# EAGLE design bikeSensor (EAGLE 7.3.0)
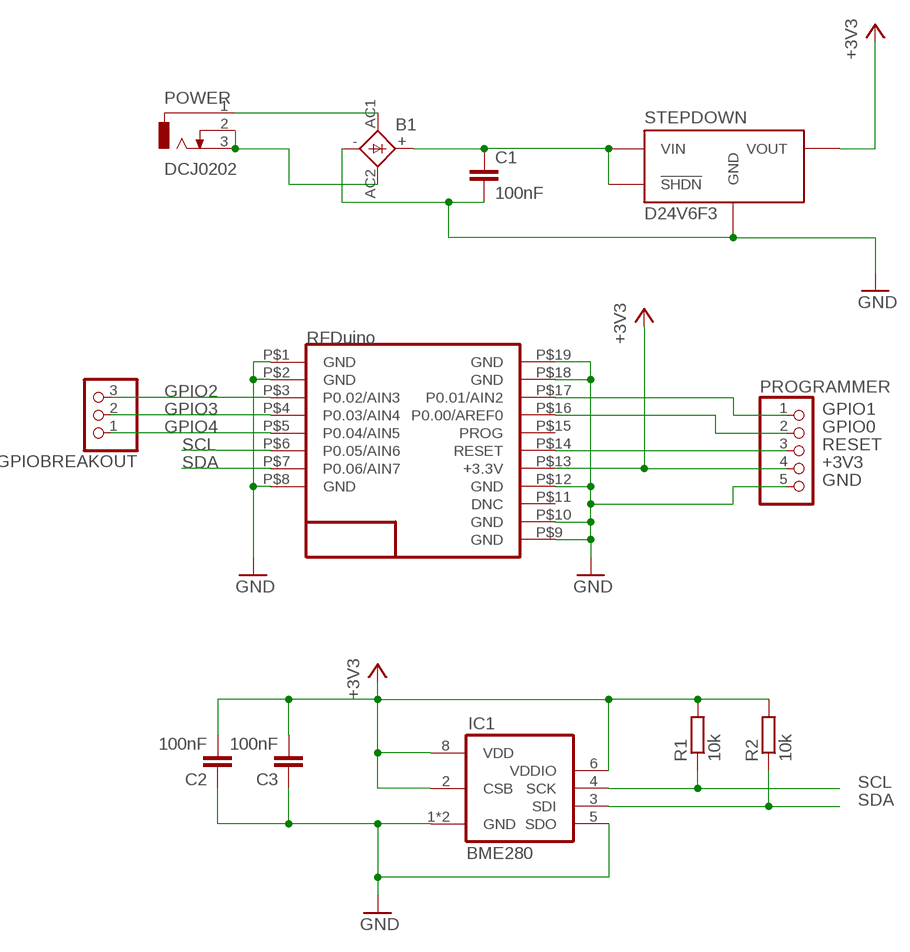
[diagram p0: schematic, sheet 1]

## Parts
B1  1KAB  [1KAB]
C1  100nF  C-EU025-050X050  [C025-050X050]
C2  100nF  C-EUC1812  [C1812]
C3  100nF  C-EUC1812  [C1812]
GPIOBREAKOUT  PINHD-1X3  [1X03]
IC1  BME280  [BME280]
POWER  DCJ0202  [DCJ0202]
PROGRAMMER  PINHD-1X5  [1X05]
R1  10k  R-EU_R1206  [R1206]
R2  10k  R-EU_R1206  [R1206]
RFDUINO  RFD22301  [RFD21733]
STEPDOWN  D24V6F3  [D24V6F3]

## Nets
+3V3: C2.2 C3.2 IC1.2(CSB) IC1.6(VDDIO) IC1.8(VDD) PROGRAMMER.4 R1.2 R2.2 RFDUINO.P$13(+3.3V) STEPDOWN.VOUT
GND: B1.- C1.2 C2.1 C3.1 IC1.1(GND) IC1.5(SDO) IC1.7(GND) PROGRAMMER.5 RFDUINO.P$1(GND) RFDUINO.P$2(GND) RFDUINO.P$8(GND) RFDUINO.P$9(GND) RFDUINO.P$10(GND) RFDUINO.P$12(GND) RFDUINO.P$18(GND) RFDUINO.P$19(GND) STEPDOWN.GND
GPIO0: PROGRAMMER.2 RFDUINO.P$16(P0.00/AREF0)
GPIO1: PROGRAMMER.1 RFDUINO.P$17(P0.01/AIN2)
GPIO2: GPIOBREAKOUT.3 RFDUINO.P$3(P0.02/AIN3)
GPIO3: GPIOBREAKOUT.2 RFDUINO.P$4(P0.03/AIN4)
GPIO4: GPIOBREAKOUT.1 RFDUINO.P$5(P0.04/AIN5)
N$1 [power]: B1.AC2 POWER.2 POWER.3
N$2 [power]: B1.AC1 POWER.1
N$5 [power]: B1.+ C1.1 STEPDOWN.!SHDN STEPDOWN.VIN
RESET: PROGRAMMER.3 RFDUINO.P$14(RESET)
SCL: IC1.4(SCK) R1.1 RFDUINO.P$6(P0.05/AIN6)
SDA: IC1.3(SDI) R2.1 RFDUINO.P$7(P0.06/AIN7)
Unconnected: RFDUINO.P$11(DNC) RFDUINO.P$15(PROG)

## Notes on the sheet
- RFDuino

## Library data of the parts
B1 = rectifier:1KAB: RECTIFIER grid 5,08 x 5,08 mm
C1-C3 = rcl:C-EU: CAPACITOR, European symbol
GPIOBREAKOUT = pinhead:PINHD-1X3: PIN HEADER
IC1 = bosch-bme280:BME280: DIGITAL HUMIDITY, PRESSURE AND TEMPERATURE SENSOR * Digital interface I²C (up to 3.4 MHz) and SPI (3 and 4 wire, up to 10 MHz)* Supply voltage VDD main supply voltage range: 1.71 V to 3.6 V*VDDIO interface voltage range: 1.2 V to 3.6 V Operating range -40…+85 °C, 0…100 % rel. humidity, 300…1100 hPa The library has been designed by Richard Magdycz <https://www.facebook.com/groups/eaglecadsoftUK>
POWER = con-jack:DCJ0202: DC POWER JACK Source: DCJ0202.pdf; OC_FARNELL: unknown; OC_NEWARK: unknown
PROGRAMMER = pinhead:PINHD-1X5: PIN HEADER
R1 R2 = rcl:R-EU_: RESISTOR, European symbol
RFDUINO = RFD22301-11.25.13:RFD22301: RF Digital RFD22301
STEPDOWN = scout:D24V6F3

## Net classes
1 power: width 0.813 mm, clearance 0.813 mm

## Board
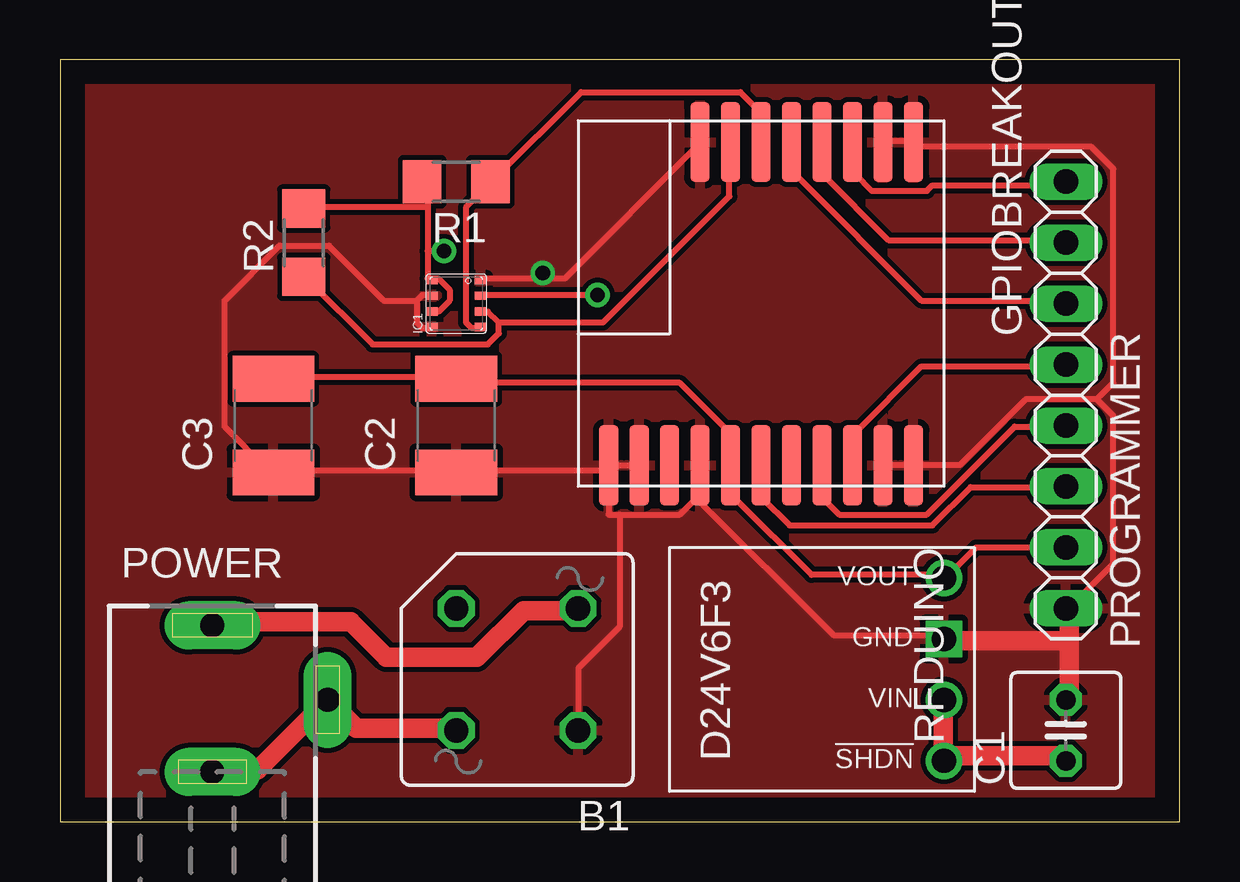
[diagram p1: board, top side]
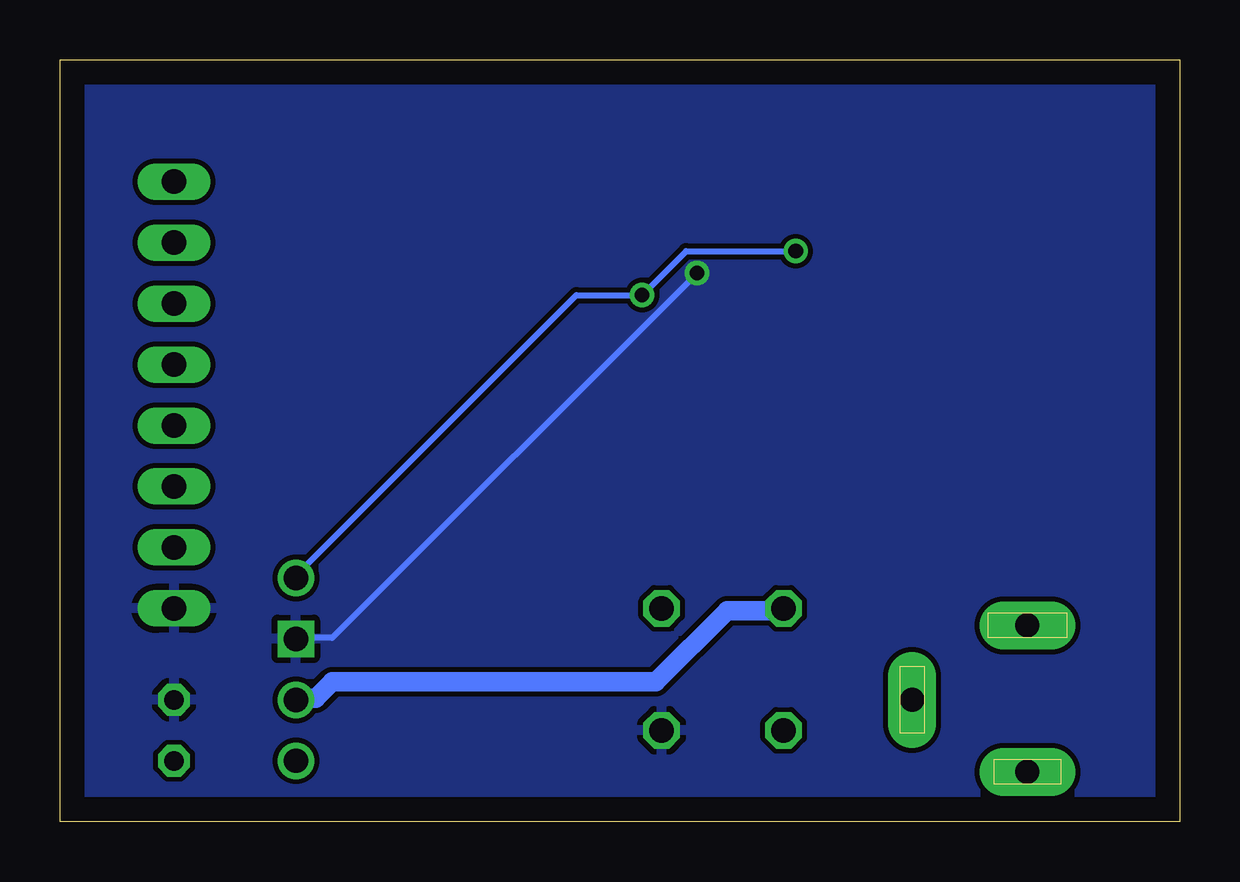
[diagram p2: board, bottom side, seen from below]

Size 46.66 x 31.74 mm. Coordinates in mm from the lower left corner, seen from the top.
Outline: 0,0 46.66,0 46.66,31.74 0,31.74 0,0
Copper layers (1*16): Top 0.035mm / dielectric 1.5mm / Bottom 0.035mm
Design rules "default": minimum track width 10mil, minimum drill 24mil, track to track 8mil, track to pad 8mil, pad to pad 8mil, via to via 8mil, smd to smd 8mil, copper to edge 40mil, drill to drill 8mil, minimum pad ring 10mil, minimum via ring 8mil, stop-mask expansion 4mil, vias tented up to drill 0mil, thermal gap 10mil

### Footprints (pad centres in the part's own frame; a part is rotated, then mirrored left to right if it is on the bottom)
1KAB = drill 1.016 octagon: + 2.54,-2.54; - -2.54,2.54; AC1 -2.54,-2.54; AC2 2.54,2.54
C025-050X050 = drill 0.813 octagon: 1 -1.27,0; 2 1.27,0
C1812 = smd 1.9 x 3.4: 1 -1.95,0; 2 1.95,0
1X03 = drill 1.016 long: 1 -2.54,0; 2 0,0; 3 2.54,0
BME280 = smd 0.35 x 0.5: 1 0.975,-1.025; 2 0.325,-1.025; 3 -0.325,-1.025; 4 -0.975,-1.025; 5 -0.975,1.025; 6 -0.325,1.025; 7 0.325,1.025; 8 0.975,1.025
DCJ0202 = drill 1 pad 2 long: 1 0,3.1; 2 4.8,0; 3 0,-3
1X05 = drill 1.016 long: 1 -5.08,0; 2 -2.54,0; 3 0,0; 4 2.54,0; 5 5.08,0
R1206 = smd 1.6 x 1.803: 1 -1.422,0; 2 1.422,0
RFD21733 = smd 3.353 x 0.813: P$1 -6.731,6.35; P$2 -6.731,5.08; P$3 -6.731,3.81; P$4 -6.731,2.54; P$5 -6.731,1.27; P$6 -6.731,0; P$7 -6.731,-1.27; P$8 -6.731,-2.54; P$9 6.731,-6.35; P$10 6.731,-5.08; P$11 6.731,-3.81; P$12 6.731,-2.54; P$13 6.731,-1.27; P$14 6.731,0; P$15 6.731,1.27; P$16 6.731,2.54; P$17 6.731,3.81; P$18 6.731,5.08; P$19 6.731,6.35
D24V6F3 = drill 1.016: !SHDN -3.81,-5.08; VIN -1.27,-5.08; VOUT 3.81,-5.08 | drill 1.016 square: GND 1.27,-5.08

### Placement (x,y rotation side)
B1  19.05,6.35 180 top
C1  41.91,3.81 90 top
C2  16.51,16.51 90 top
C3  8.89,16.51 90 top
GPIOBREAKOUT  41.91,24.13 90 top
IC1  16.51,21.59 90 top
POWER  6.35,5.08 0 top
PROGRAMMER  41.91,13.97 270 top
R1  16.51,26.67 180 top
R2  10.16,24.13 90 top
RFDUINO  29.21,21.59 270 top
STEPDOWN  31.75,6.35 90 top

### Tracks (layer width: path | path; a pad name or v marks a point on that pad's centre or on a via)
+3V3  (via drill 0.61)
  Top 0.254: C3.2 8.91,18.52 16.46,18.52 C2.2 16.69,18.29 25.83,18.29 27.89,16.23 27.89,14.86 RFDUINO.P$13 28.12,14.86 28.12,13.49 31.32,10.29 36.8,10.29 STEPDOWN.VOUT 37.03,10.29 38.18,11.43 PROGRAMMER.4 | IC1.6 15.54,21.26 15.77,21.26 16.23,21.72 16.23,22.17 15.77,22.63 15.54,22.63 IC1.8 15.32,22.63 15.32,23.77 | 15.32,25.6 15.32,26.52 R1.2 | 15.32,25.6 15.32,23.77 | 15.32,25.6 10.29,25.6 R2.2 | v22.4,21.95 17.6,21.95 IC1.2 | v16,23.77 15.32,23.77
  Bottom 0.254: STEPDOWN.VOUT 36.8,10.29 25.15,21.95 v22.4,21.95 20.57,23.77 v16,23.77
GND  (via drill 0.61)
  Top 0.254: RFDUINO.P$2 34.29,28.35 35.43,28.35 RFDUINO.P$1 35.66,28.12 42.98,28.12 43.89,27.2 43.89,18.29 43.2,17.6 | RFDUINO.P$18 RFDUINO.P$19 37.49,14.86 40.23,17.6 43.2,17.6 | 42.06,5.26 C1.2 | 42.06,8.69 PROGRAMMER.5 42.06,8.91 43.89,10.74 43.89,16.92 43.2,17.6 | 37.03,7.54 STEPDOWN.GND 36.8,7.77 32.23,7.77 26.52,13.49 | 14.86,21.72 14.86,20.8 15.09,20.57 15.32,20.57 IC1.5 | 14.86,21.72 15.09,21.95 15.32,21.95 IC1.7 | 14.86,21.72 13.49,21.72 11.2,24 9.14,24 6.86,21.72 6.86,16.46 8.69,14.63 C3.1 8.91,14.63 16.46,14.63 C2.1 16.69,14.63 22.86,14.63 | 20.12,22.63 21.03,22.63 26.52,28.12 RFDUINO.P$8 | 20.12,22.63 17.6,22.63 IC1.1 | 22.86,14.63 22.86,12.8 23.32,12.8 | RFDUINO.P$10 RFDUINO.P$9 22.86,14.63 | 26.52,13.49 26.52,14.86 RFDUINO.P$12 26.52,13.49 | 26.52,13.49 25.83,12.8 23.32,12.8 | v20.12,22.86 20.12,22.63 | 23.32,12.8 23.32,8.12 21.6,6.4 21.6,3.89 B1.-
  Top 0.813: 42.06,8.69 42.06,7.54 | 42.06,7.54 42.06,5.26 | 42.06,7.54 37.03,7.54
  Bottom 0.254: v20.12,22.86 35.32,7.66 36.8,7.66 STEPDOWN.GND
  pour Top: 0,31.75 46.99,31.75 46.99,0 0,0
  pour Bottom: 0,0 0,31.75 46.99,31.75 46.99,0
GPIO0
  Top 0.254: PROGRAMMER.2 41.83,16.46 39.78,16.46 36.12,12.8 32.46,12.8 31.77,13.49 31.77,14.86 RFDUINO.P$16
GPIO1
  Top 0.254: PROGRAMMER.1 41.83,18.97 35.89,18.97 33.15,16.23 33.15,14.86 RFDUINO.P$17
GPIO2
  Top 0.254: GPIOBREAKOUT.3 41.83,26.52 36.35,26.52 36.12,26.29 33.83,26.29 33.15,26.98 33.15,28.12 RFDUINO.P$3
GPIO3
  Top 0.254: GPIOBREAKOUT.2 41.83,24.23 34.52,24.23 31.77,26.98 31.77,28.12 RFDUINO.P$4
GPIO4
  Top 0.254: GPIOBREAKOUT.1 41.83,21.72 35.89,21.72 30.63,26.98 30.63,28.12 RFDUINO.P$5
N$1
  Top 0.813: B1.AC2 16.46,3.89 12.34,3.89 11.2,5.03 POWER.2 10.86,4.8 8.23,2.17 6.4,2.17 POWER.3
N$2
  Top 0.813: B1.AC1 21.49,8.8 19.32,8.8 17.37,6.86 13.6,6.86 12.12,8.34 6.51,8.34 6.4,8.23 POWER.1
N$5
  Top 0.813: C1.1 41.83,2.74 37.03,2.74 STEPDOWN.!SHDN 36.8,2.74 36.8,5.03 STEPDOWN.VIN
  Bottom 0.813: 36.8,2.52 STEPDOWN.!SHDN | B1.+ 16.57,8.8 18.86,8.8 21.83,5.83 35.32,5.83 36.01,5.14 36.8,5.14 STEPDOWN.VIN
RESET
  Top 0.254: PROGRAMMER.3 41.83,13.95 37.95,13.95 36.35,12.34 30.4,12.34 29.26,13.49 29.26,14.86 RFDUINO.P$14
SCL
  Top 0.254: IC1.4 17.37,20.57 17.14,20.57 16.92,20.8 16.92,25.6 17.83,26.52 R1.1 18.06,26.75 21.72,30.4 28.35,30.4 29.03,29.72 29.03,28.35 RFDUINO.P$6
SDA
  Top 0.254: 18.29,20.8 17.83,21.26 17.6,21.26 IC1.3 | 18.29,20.8 18.29,20.34 17.83,19.89 13.03,19.89 10.29,22.63 R2.1 | 18.29,20.8 22.63,20.8 27.89,26.06 27.89,28.12 RFDUINO.P$7